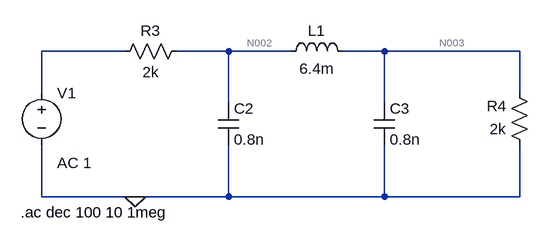
[diagram p0: schematic Draft5.asc]
Draft5.asc, the LTspice schematic file:
Version 4
SHEET 1 1060 792
WIRE 432 528 304 528
WIRE 592 528 512 528
WIRE 688 528 592 528
WIRE 832 528 768 528
WIRE 1040 528 832 528
WIRE 304 592 304 528
WIRE 1040 592 1040 528
WIRE 592 608 592 528
WIRE 832 608 832 528
WIRE 304 752 304 672
WIRE 448 752 304 752
WIRE 592 752 592 672
WIRE 592 752 448 752
WIRE 832 752 832 672
WIRE 832 752 592 752
WIRE 1040 752 1040 672
WIRE 1040 752 832 752
FLAG 448 752 0
SYMBOL res 528 512 R90
WINDOW 0 0 56 VBottom 2
WINDOW 3 32 56 VTop 2
SYMATTR InstName R3
SYMATTR Value 2k
SYMBOL res 1056 688 R180
WINDOW 0 36 76 Left 2
WINDOW 3 36 40 Left 2
SYMATTR InstName R4
SYMATTR Value 2k
SYMBOL cap 576 608 R0
SYMATTR InstName C2
SYMATTR Value 0.8n
SYMBOL cap 816 608 R0
SYMATTR InstName C3
SYMATTR Value 0.8n
SYMBOL ind 672 544 R270
WINDOW 0 32 56 VTop 2
WINDOW 3 5 56 VBottom 2
SYMATTR InstName L1
SYMATTR Value 6.4m
SYMBOL voltage 304 576 R0
WINDOW 123 24 124 Left 2
WINDOW 39 0 0 Left 0
SYMATTR Value2 AC 1
SYMATTR InstName V1
SYMATTR Value ""
TEXT 272 776 Left 2 !.ac dec 100 10 1meg

The netlist it stands for:
* Draft5.asc
R3 N002 N001 2k
R4 0 N003 2k
C2 N002 0 0.8n
C3 N003 0 0.8n
L1 N002 N003 6.4m
V1 N001 0 AC 1
.ac dec 100 10 1meg
.backanno
.end

* Results of the author's LTspice run, read from the files saved beside the schematic
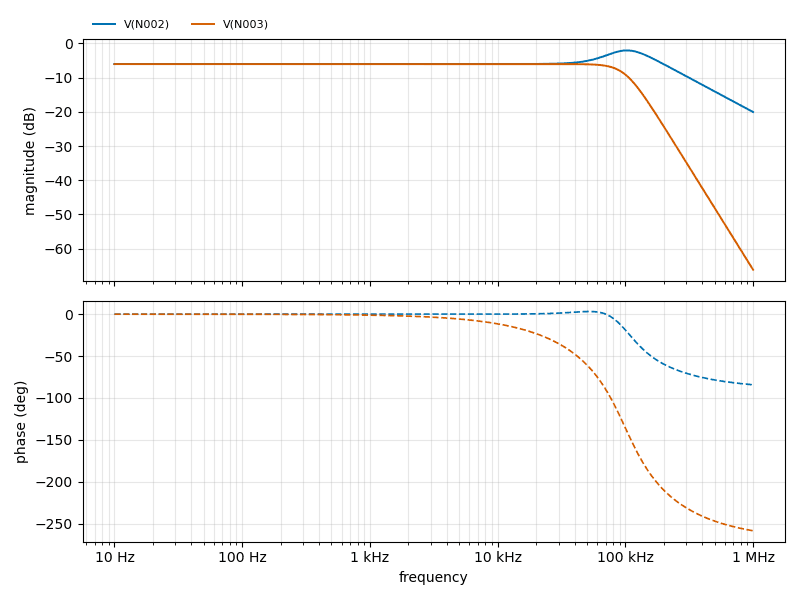
[diagram p1: AC Analysis of Draft5.asc, plotted from the saved traces]
* AC Analysis, 1 run:
*   V(N002): -6.02 dB at 10 Hz, -20.05 dB at 1 MHz, peak -2.03 dB at 102.3 kHz, 3 dB below the peak at 51 kHz and 177.1 kHz
*   V(N003): -6.02 dB at 10 Hz, -66.16 dB at 1 MHz, peak -6.02 dB at 10.47 Hz, 3 dB below the peak at 99.46 kHz